# EasyEDA schematic SCH_Sculpfun S9 enclosure_2022-10-28.json

## Sheets
1 Wemos board: TITLE: Sculpfun S9 enclosure - Wemos board; REV: 1.0; Date: 2022-06-20; Sheet: 1/1; Drawn By: Fabrizio Fiorucci; Company: 65397
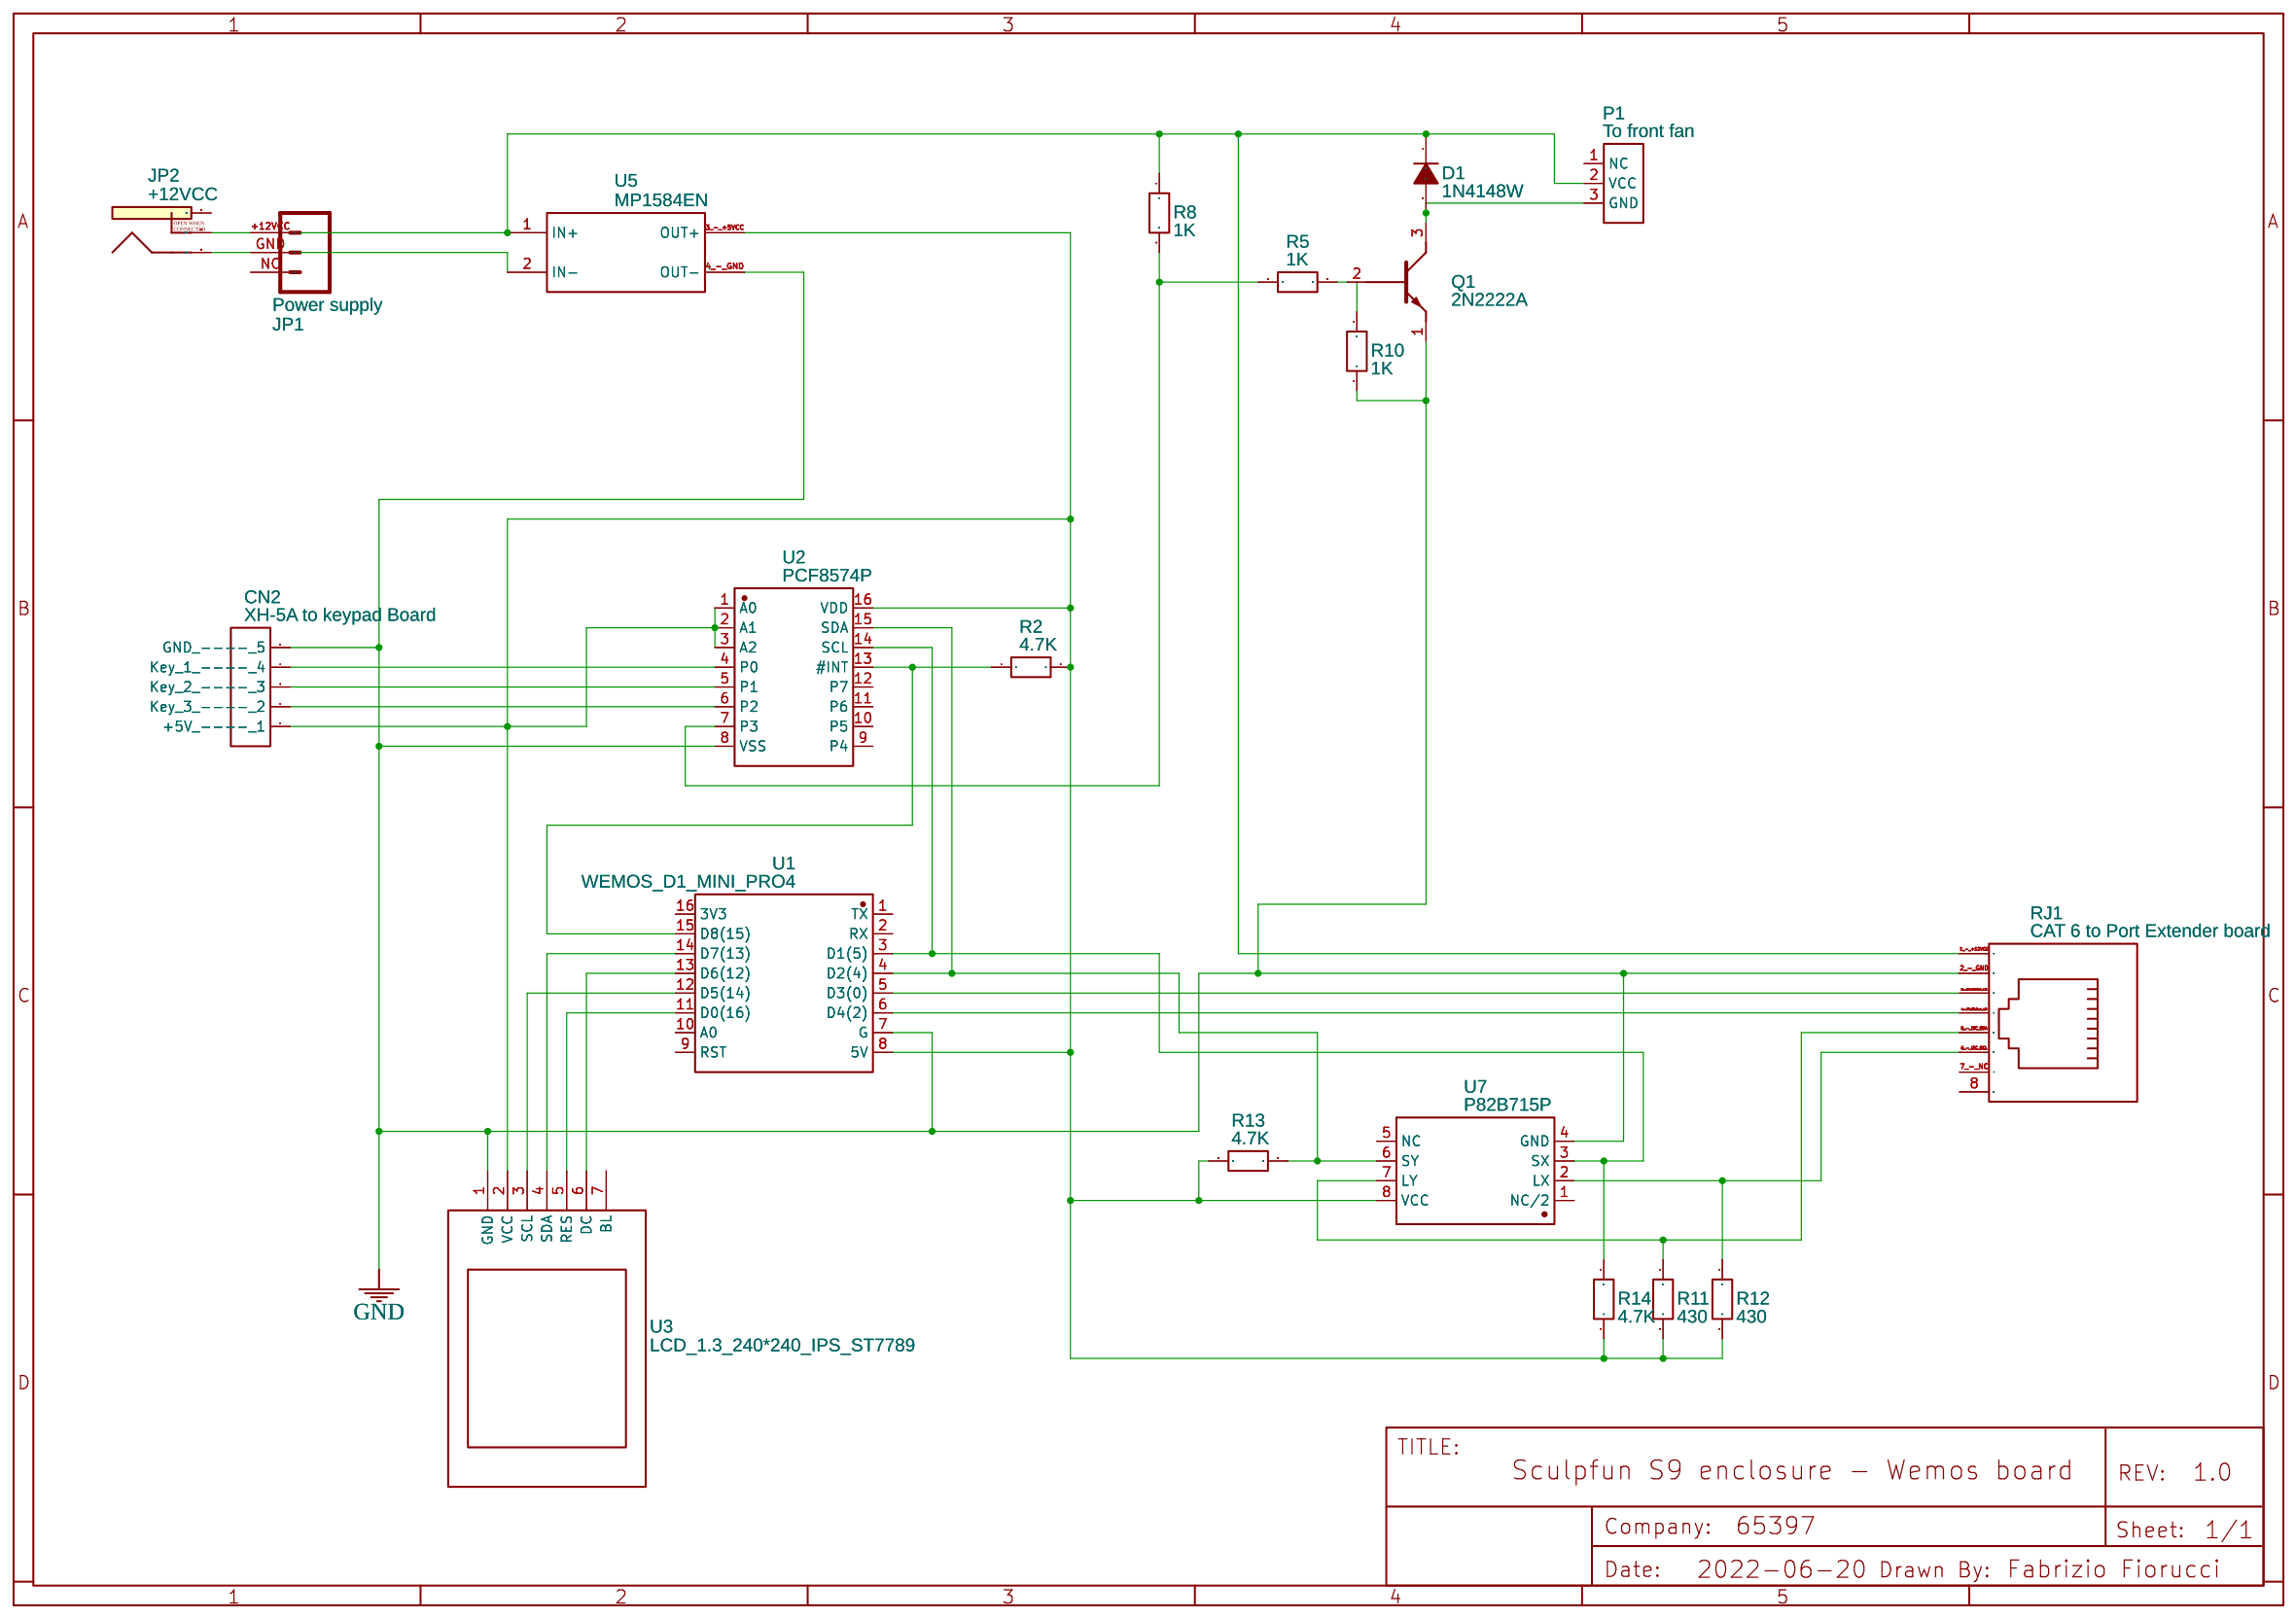
[diagram p0: Wemos board]
2 Keypad board: TITLE: Sculpfun S9 enclosure - Keypad board
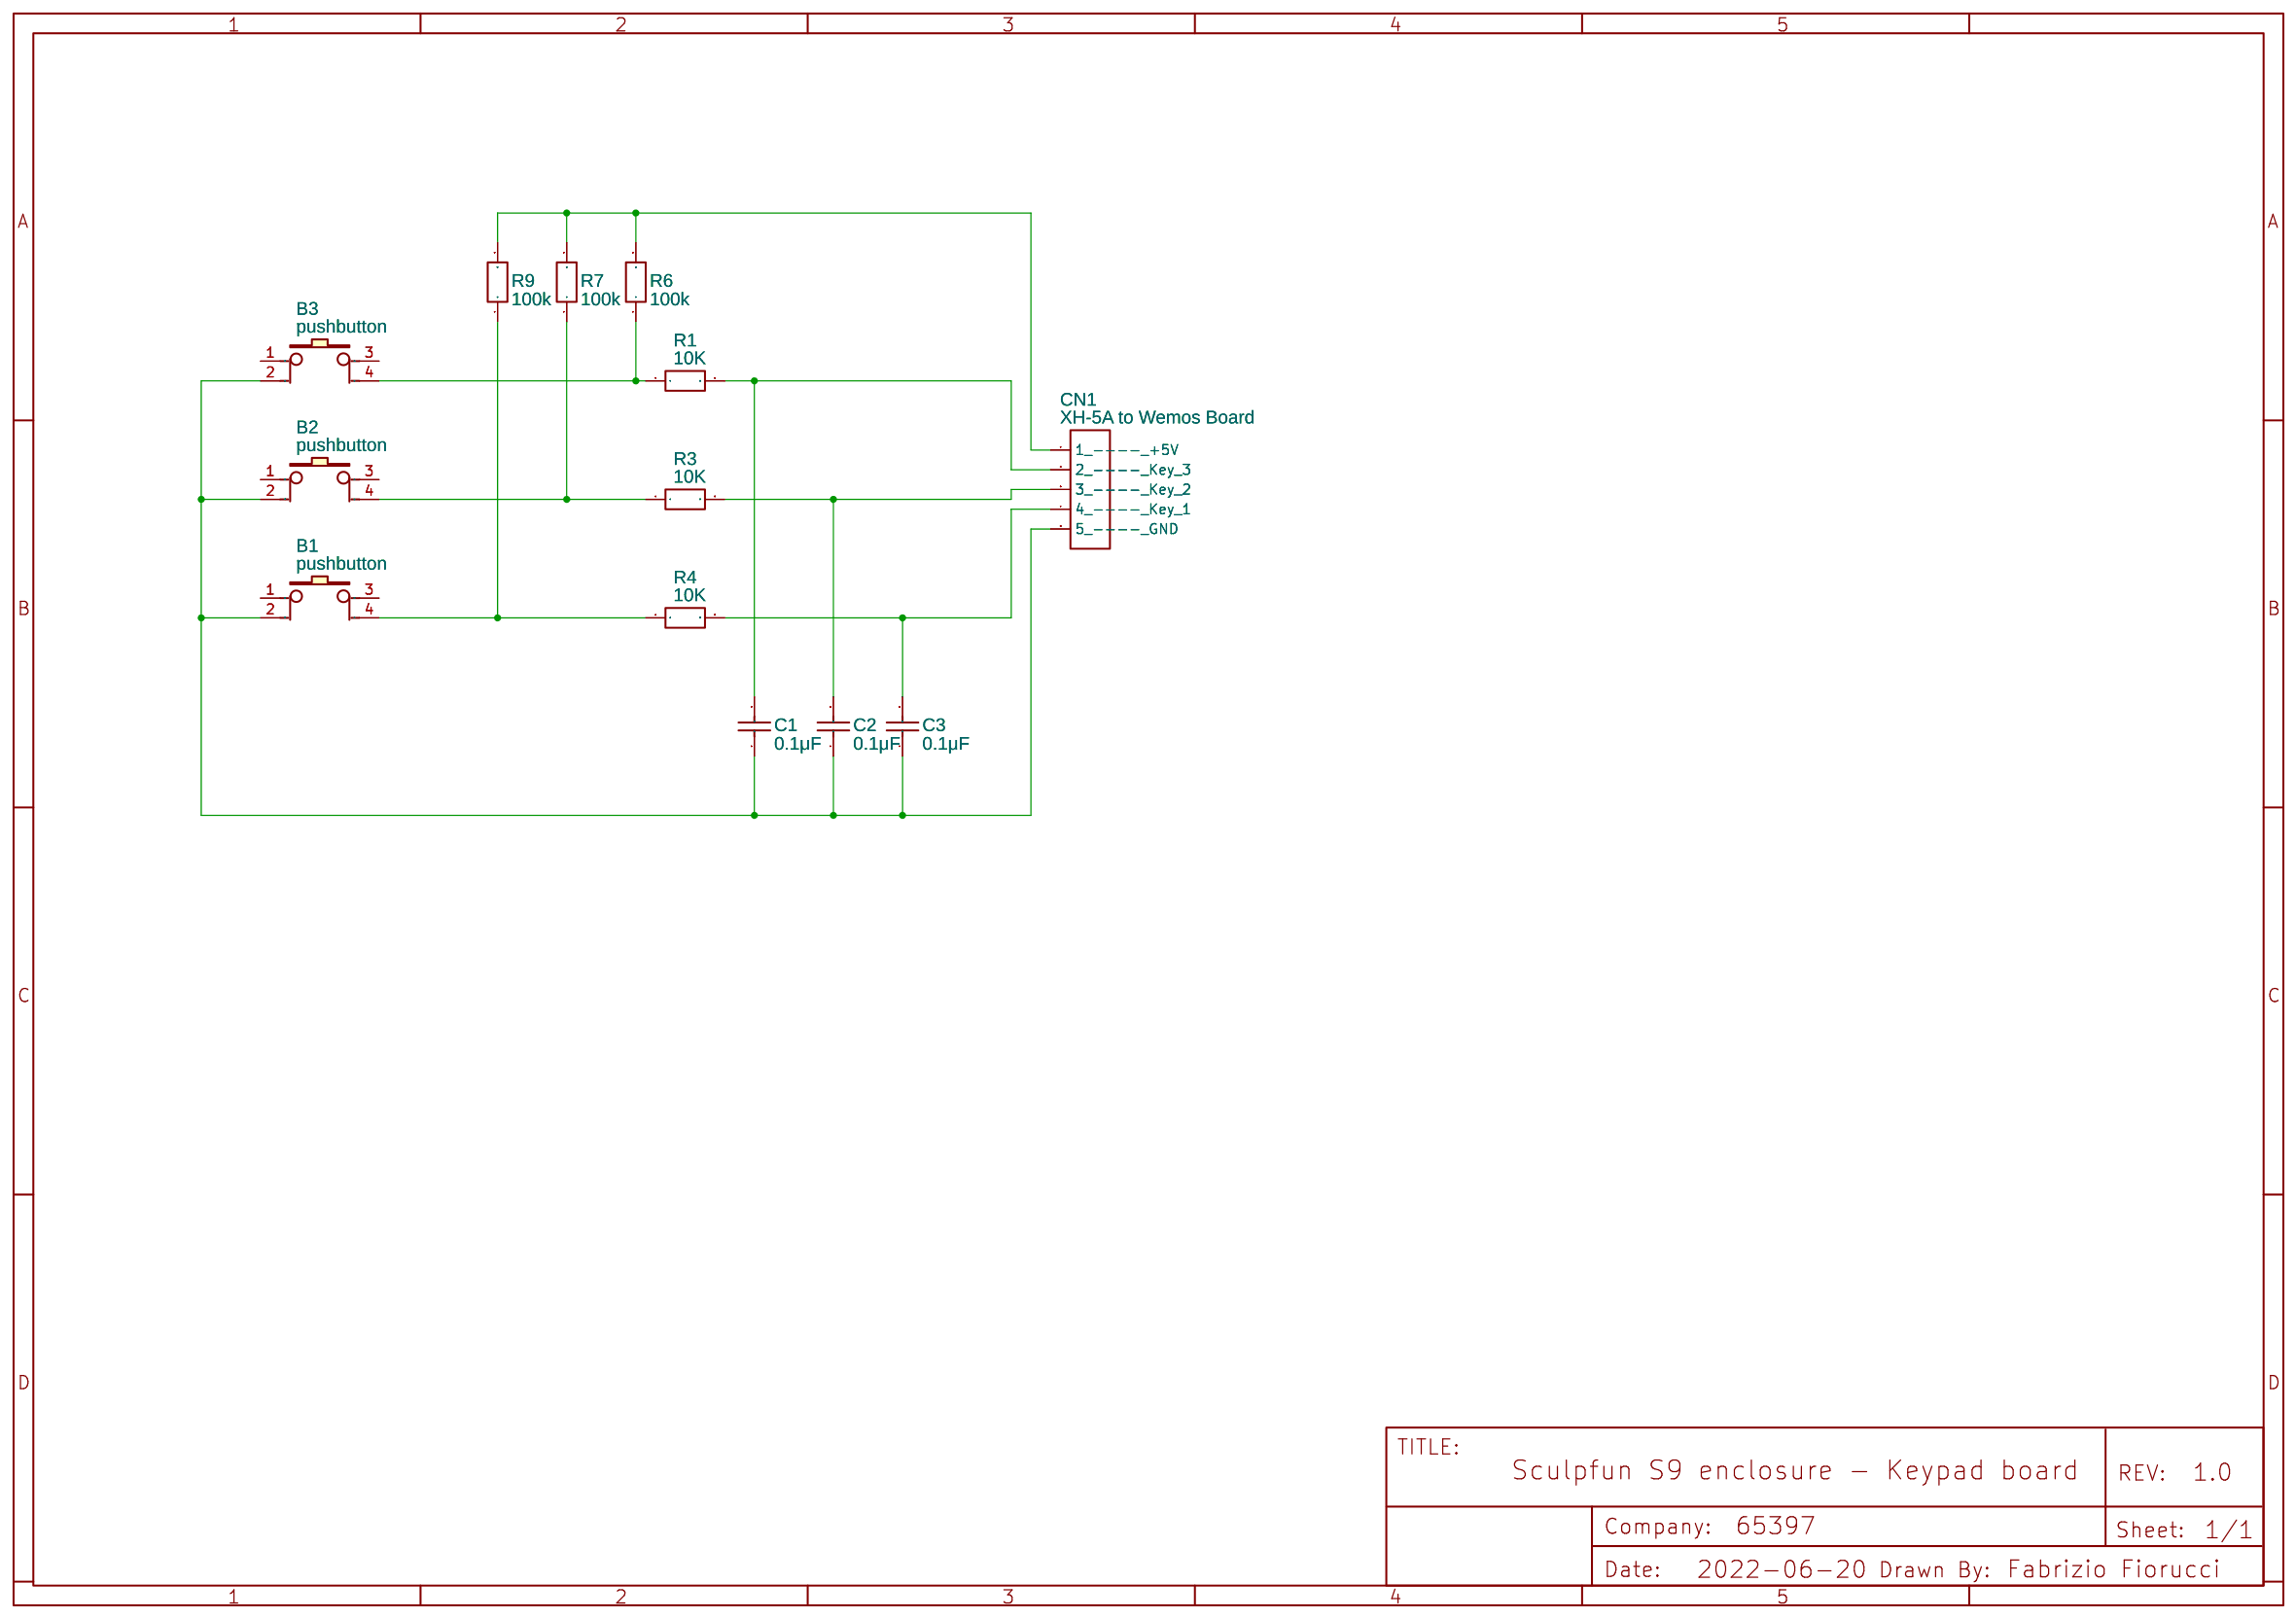
[diagram p1: Keypad board]
3 Port extender board: TITLE: Sculpfun S9 enclosure - Port extender board
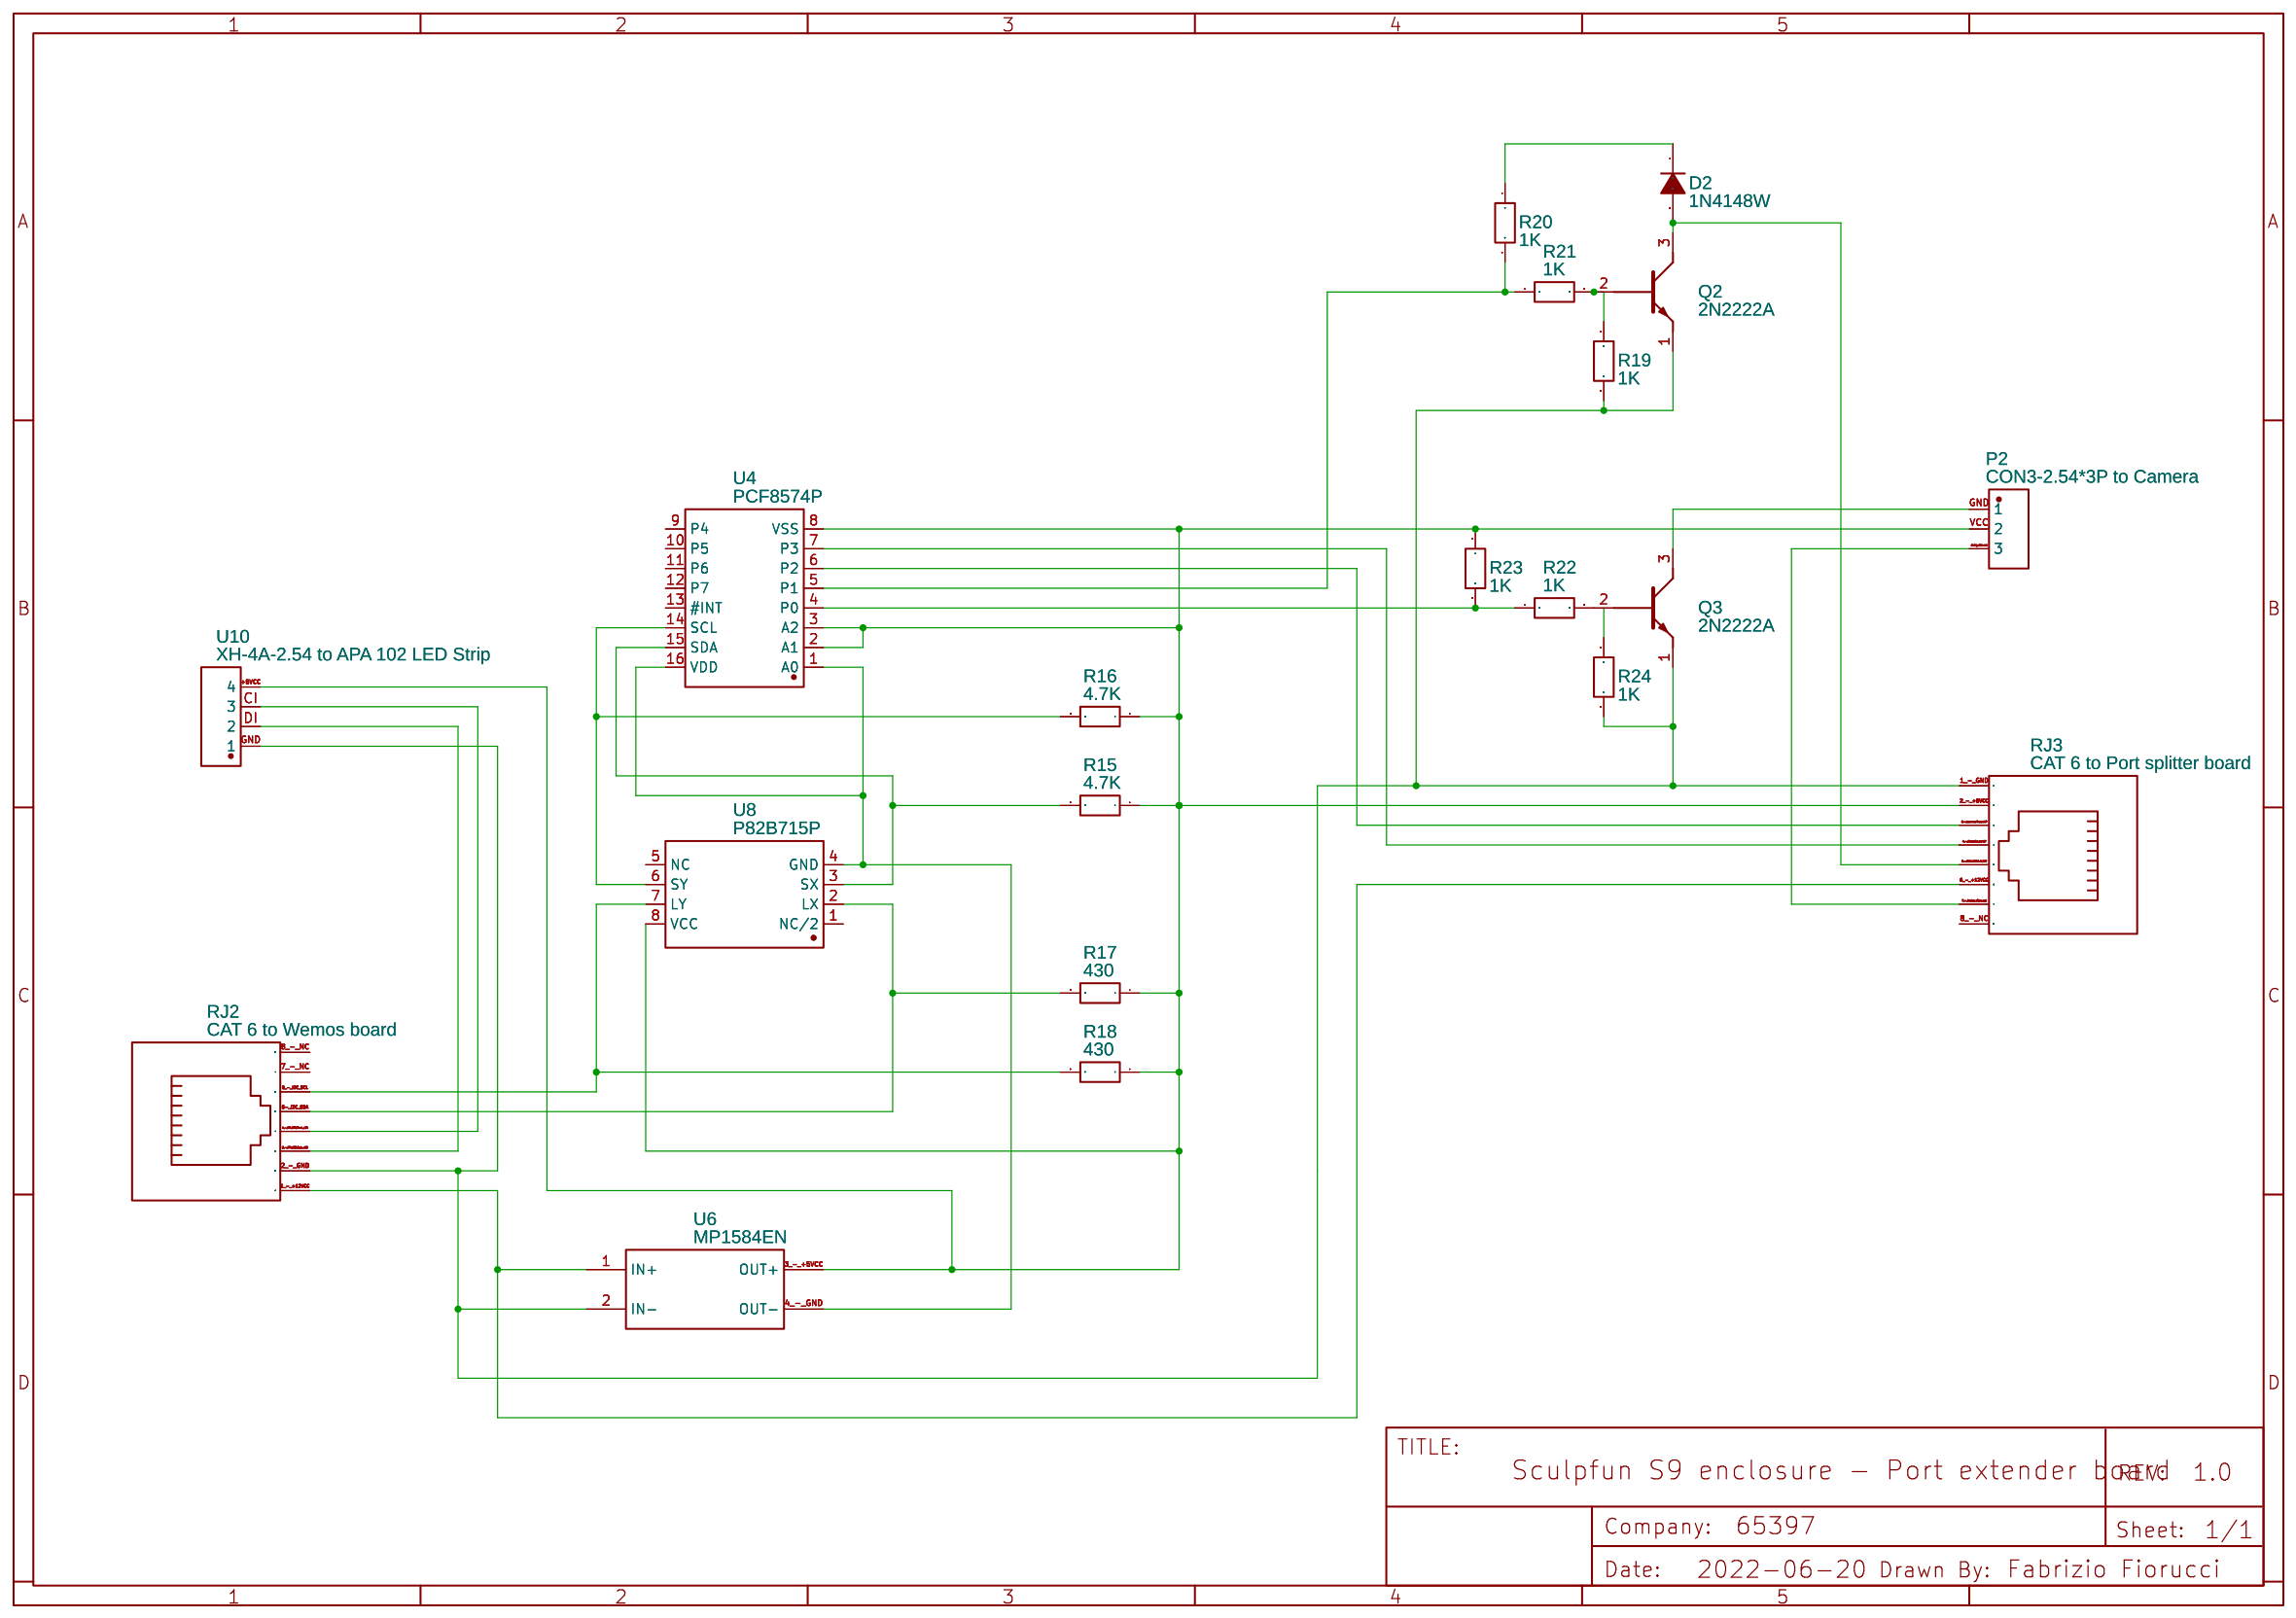
[diagram p2: Port extender board]

## Parts
sheet Keypad board
B1  pushbutton  [KEY-TH_4P-L6.0-W6.0-P4.50]
B2  pushbutton  [KEY-TH_4P-L6.0-W6.0-P4.50]
B3  pushbutton  [KEY-TH_4P-L6.0-W6.0-P4.50]
C1  0.1μF  [CAP-TH_L6.5-W4.0-P5.00-D1.0]
C2  0.1μF  [CAP-TH_L6.5-W4.0-P5.00-D1.0]
C3  0.1μF  [CAP-TH_L6.5-W4.0-P5.00-D1.0]
CN1  XH-5A to Wemos Board  [XH-5A]
R1  10K  [RES-TH_BD5.0-L15.5-P19.50-D0.8]
R3  10K  [RES-TH_BD5.0-L15.5-P19.50-D0.8]
R4  10K  [RES-TH_BD5.0-L15.5-P19.50-D0.8]
R6  100k  [RES-TH_BD5.0-L15.5-P19.50-D0.8]
R7  100k  [RES-TH_BD5.0-L15.5-P19.50-D0.8]
R9  100k  [RES-TH_BD5.0-L15.5-P19.50-D0.8]
sheet Port extender board
D2  1N4148W  [SOD-123_L2.8-W1.8-LS3.7-RD]
P2  CON3-2.54*3P to Camera  [CONN-TH_XH2.54-3P]
Q2  2N2222A  [2N2222A]
Q3  2N2222A  [2N2222A]
R15  4.7K  [RESISTOR_DECADE_DUMMYRESISTOR]
R16  4.7K  [RESISTOR_DECADE_DUMMYRESISTOR]
R17  430  [RESISTOR_DECADE_DUMMYRESISTOR]
R18  430  [RESISTOR_DECADE_DUMMYRESISTOR]
R19  1K  [RESISTOR_DECADE_DUMMYRESISTOR]
R20  1K  [RESISTOR_DECADE_DUMMYRESISTOR]
R21  1K  [RESISTOR_DECADE_DUMMYRESISTOR]
R22  1K  [RESISTOR_DECADE_DUMMYRESISTOR]
R23  1K  [RESISTOR_DECADE_DUMMYRESISTOR]
R24  1K  [RESISTOR_DECADE_DUMMYRESISTOR]
RJ2  CAT 6 to Wemos board  [RJ45-TH_R-RJ45R08P-A004]
RJ3  CAT 6 to Port splitter board  [RJ45-TH_R-RJ45R08P-A004]
U4  PCF8574P  [DIP-16_L19.3-W6.4-P2.54-LS7.6-BL]
U6  MP1584EN  [REGULATOR-MP1584]
U8  P82B715P  [DIP-8_L10.3-W7.5-P1.27-LS10.3-BL]
U10  XH-4A-2.54 to APA 102 LED Strip  [CONN-TH_4P-P2.50-XH2.54-4P]
sheet Wemos board
CN2  XH-5A to keypad Board  [XH-5A]
D1  1N4148W  [SOD-123_L2.8-W1.8-LS3.7-RD]
JP1  Power supply  [JST-3-PTH-VERT]
JP2  +12VCC  [RCA]
P1  To front fan  [HEADER-PINS_2.54_04PIN_01ROW]
Q1  2N2222A  [2N2222A]
R2  4.7K  [RESISTOR_DECADE_DUMMYRESISTOR]
R5  1K  [RESISTOR_DECADE_DUMMYRESISTOR]
R8  1K  [RESISTOR_DECADE_DUMMYRESISTOR]
R10  1K  [RESISTOR_DECADE_DUMMYRESISTOR]
R11  430  [RESISTOR_DECADE_DUMMYRESISTOR]
R12  430  [RESISTOR_DECADE_DUMMYRESISTOR]
R13  4.7K  [RESISTOR_DECADE_DUMMYRESISTOR]
R14  4.7K  [RESISTOR_DECADE_DUMMYRESISTOR]
RJ1  CAT 6 to Port Extender board  [RJ45-TH_R-RJ45R08P-A004]
U1  WEMOS_D1_MINI_PRO4  [DIP-16_WEMOS_D1_MINI_PRO4]
U2  PCF8574P  [DIP-16_L19.3-W6.4-P2.54-LS7.6-BL]
U3  LCD_1.3_240*240_IPS_ST7789  [LCD_1.3_240*240_IPS_ST7789]
U5  MP1584EN  [REGULATOR-MP1584]
U7  P82B715P  [DIP-8_L10.3-W7.5-P1.27-LS10.3-BL]

## Library data of the parts
B1-B3 = button6*6*8.5: Supplier Part: C59980; Supplier: LCSC; Manufacturer: ReliaPro; image: http://image.lceda.cn/szlcsc/C59980.jpg
C1-C3 = CAPACITOR15NF100V: Supplier: LCSC; Manufacturer: ReliaPro; Manufacturer Part: Capacitor15nf100v; Contributor: LCSC; Supplier Part: C26191
CN1 CN2 = XH-5A: Manufacturer: BOOMELE(Boom Precision Elec); Supplier: LCSC; Supplier Part: C2318; link: https://datasheet.lcsc.com/szlcsc/1811151411_BOOMELE-Boom-Precision-Elec-XH-5A_C2318.pdf; Contributor: Junikos
R1 R3 R4 R6 R7 R9 = RD 3WS 10K J T/B A1: Supplier: LCSC; Supplier Part: C433821; Manufacturer: TyoHM; Contributor: LCSC
D1 D2 = 1N4148W: Supplier: LCSC; Manufacturer: HT; Contributor: LCSC; Supplier Part: C179717; JLCPCB Part Class: Extended Part
P2 = CON3-2.54*3P: Supplier: LCSC; Supplier Part: C9900003185; Manufacturer: null; JLCPCB Part Class: Extended Part; Contributor: LCSC
Q1-Q3 = 2N2222A_2N2222A: Contributor: martijnschroder
R2 R5 R8 R10-R24 = RESISTOR_DECADE_DUMMYS: Supplier: LCSC; Supplier Part: C464026; Manufacturer: BOURNS; Contributor: LCSC
RJ1-RJ3 = R-RJ45R08P-A004 COPY: Supplier: LCSC; Supplier Part: C385834; Manufacturer: Shenzhen Cankemeng; Manufacturer Part: R-RJ45R08P-A004; Contributor: LCSC; JLCPCB Part Class: Extended Part
U2 U4 = PCF8574P: Supplier: LCSC; Supplier Part: C398073; Manufacturer: HGSEMI; Contributor: LCSC; JLCPCB Part Class: Extended Part
U5 U6 = Regulator: Contributor: auyeungkl999
U7 U8 = P82B715P: Supplier: LCSC; Manufacturer: TI; Supplier Part: C134037; JLCPCB Part Class: Extended Part
U10 = XH-4A-2.54: Supplier: LCSC; Supplier Part: C9900009905; Manufacturer: null; link: https://atta.szlcsc.comnull; JLCPCB Part Class: Extended Part; Contributor: LCSC
JP1 = M03: Contributor: SparkFun
JP2 = RCA: Contributor: SparkFun
P1 = 3 PIN HEADER: Contributor: rn98
U1 = WEMOS_D1_MINI_PRO4: Supplier: LCSC; Supplier Part: C2837266; Manufacturer: null; Manufacturer Part: Wemos_D1_mini_Pro4; Contributor: LCSC; JLCPCB Part Class: Extended Part
U3 = LCD_1.3_240*240_IPS_ST7789: Contributor: puzrin

## Nets
GND: CN2.5(GND ---- 5) Q1.1 R10.2 RJ1.2 - GND(2) U1.7(G) U2.8(VSS) U3.1(GND) U5.4 - GND(OUT-) U7.4(GND)
Net-(B1-2): B1.2 B2.2 B3.2 C1.1 C2.1 C3.1 CN1.5(5 ---- GND)
Net-(B1-4): B1.4 R4.1 R9.1
Net-(B2-4): B2.4 R3.1 R7.1
Net-(B3-4): B3.4 R1.1 R6.1
Net-(C1-2): C1.2 CN1.2(2 ---- Key 3) R1.2
Net-(C2-2): C2.2 CN1.3(3 ---- Key 2) R3.2
Net-(C3-2): C3.2 CN1.4(4 ---- Key 1) R4.2
Net-(CN1-1): CN1.1(1 ---- +5V) R6.2 R7.2 R9.2
Net-(CN2-1): CN2.1(+5V ---- 1) R2.2 R11.2 R12.2 R13.2 R14.2 U1.8(5V) U2.1(A0) U2.2(A1) U2.3(A2) U2.16(VDD) U3.2(VCC) U5.3 - +5VCC(OUT+) U7.8(VCC)
Net-(CN2-2): CN2.2(Key 3 ---- 2) U2.6(P2)
Net-(CN2-3): CN2.3(Key 2 ---- 3) U2.5(P1)
Net-(CN2-4): CN2.4(Key 1 ---- 4) U2.4(P0)
Net-(D1-1): D1.1(K) P1.2(VCC) R8.1 RJ1.1 - +12VCC(1) U5.1(IN+)
Net-(D1-2): D1.2(A) P1.3(GND) Q1.3
Net-(D2-1): D2.1(K) R20.1
Net-(D2-2): D2.2(A) Q2.3 RJ3.5 - Exhaust fan on/off(5)
Net-(JP1-+12VCC): JP1.+12VCC(3) JP2.SWITCH
Net-(JP1-GND): JP1.GND(2) JP2.SHELL
Net-(P2-Analog video out): P2.Analog video out(3) RJ3.7 - Analog video out(7)
Net-(P2-GND): P2.GND(1) Q3.3
Net-(P2-VCC): P2.VCC(2) R15.1 R16.1 R17.1 R18.1 R23.1 RJ3.2 - +5VCC(2) U4.2(A1) U4.3(A2) U4.8(VSS) U6.3 - +5VCC(OUT+) U8.8(VCC) U10.+5VCC(4)
Net-(Q1-2): Q1.2 R5.2
Net-(Q2-1): Q2.1 Q3.1 R19.2 R24.2 RJ2.2 - GND(2) RJ3.1 - GND(1) U6.2(IN-) U10.GND(1)
Net-(Q2-2): Q2.2 R19.1 R21.2
Net-(Q3-2): Q3.2 R22.2
Net-(R2-1): R2.1 U1.15(D8(15)) U2.13(#INT)
Net-(R5-1): R5.1 R8.2 U2.7(P3)
Net-(R11-1): R11.1 RJ1.5 - I2C SDA(5) U7.7(LY)
Net-(R12-1): R12.1 RJ1.6 - I2C SCL(6) U7.2(LX)
Net-(R13-1): R13.1 U1.4(D2(4)) U2.15(SDA) U7.6(SY)
Net-(R14-1): R14.1 U1.3(D1(5)) U2.14(SCL) U7.3(SX)
Net-(R15-2): R15.2 U4.15(SDA) U8.3(SX)
Net-(R16-2): R16.2 U4.14(SCL) U8.6(SY)
Net-(R17-2): R17.2 RJ2.5- I2C SDA(5) U8.2(LX)
Net-(R18-2): R18.2 RJ2.6 - I2C SCL(6) U8.7(LY)
Net-(R20-2): R20.2 R21.1 U4.5(P1)
Net-(R22-1): R22.1 R23.2 U4.4(P0)
Net-(RJ1-3 - APA 102 Data / DI): RJ1.3 - APA 102 Data / DI(3) U1.5(D3(0))
Net-(RJ1-4 - APA 102 Clock / CI): RJ1.4 - APA 102 Clock / CI(4) U1.6(D4(2))
Net-(RJ2-1 - +12VCC): RJ2.1 - +12VCC(1) RJ3.6 - +12VCC(6) U6.1(IN+)
Net-(RJ2-3 - APA 102 Data / DI): RJ2.3 - APA 102 Data / DI(3) U10.DI(2)
Net-(RJ2-4 - APA 102 Clock / CI): RJ2.4 - APA 102 Clock / CI(4) U10.CI(3)
Net-(RJ3-3 - Laser machine on/off): RJ3.3 - Laser machine on/off(3) U4.6(P2)
Net-(RJ3-4 - Air assist on/off): RJ3.4 - Air assist on/off(4) U4.7(P3)
Net-(U1-11): U1.11(D0(16)) U3.5(RES)
Net-(U1-12): U1.12(D5(14)) U3.3(SCL)
Net-(U1-13): U1.13(D6(12)) U3.6(DC)
Net-(U1-14): U1.14(D7(13)) U3.4(SDA)
Net-(U4-1): U4.1(A0) U4.16(VDD) U6.4 - GND(OUT-) U8.4(GND)

Not connected (* = marked no-connect by the designer): B1 1 3; B2 1 3; B3 1 3; JP1 NC(1); JP2 PIN; P1 1(NC); R10 1; R24 1; RJ1 7 - NC(7) 8; RJ2 7 - NC(7) 8 - NC(8); RJ3 8 - NC(8); U1 1(TX) 2(RX) 9(RST) 10(A0) 16(3V3); U2 9(P4) 10(P5) 11(P6) 12(P7); U3 7(BL); U4 9(P4) 10(P5) 11(P6) 12(P7) 13(#INT); U5 2(IN-); U7 1(NC/2) 5(NC); U8 1(NC/2) 5(NC)
